# EAGLE design SAMDi_version4 (EAGLE 7.1.0)

## Sheet 1 of 2
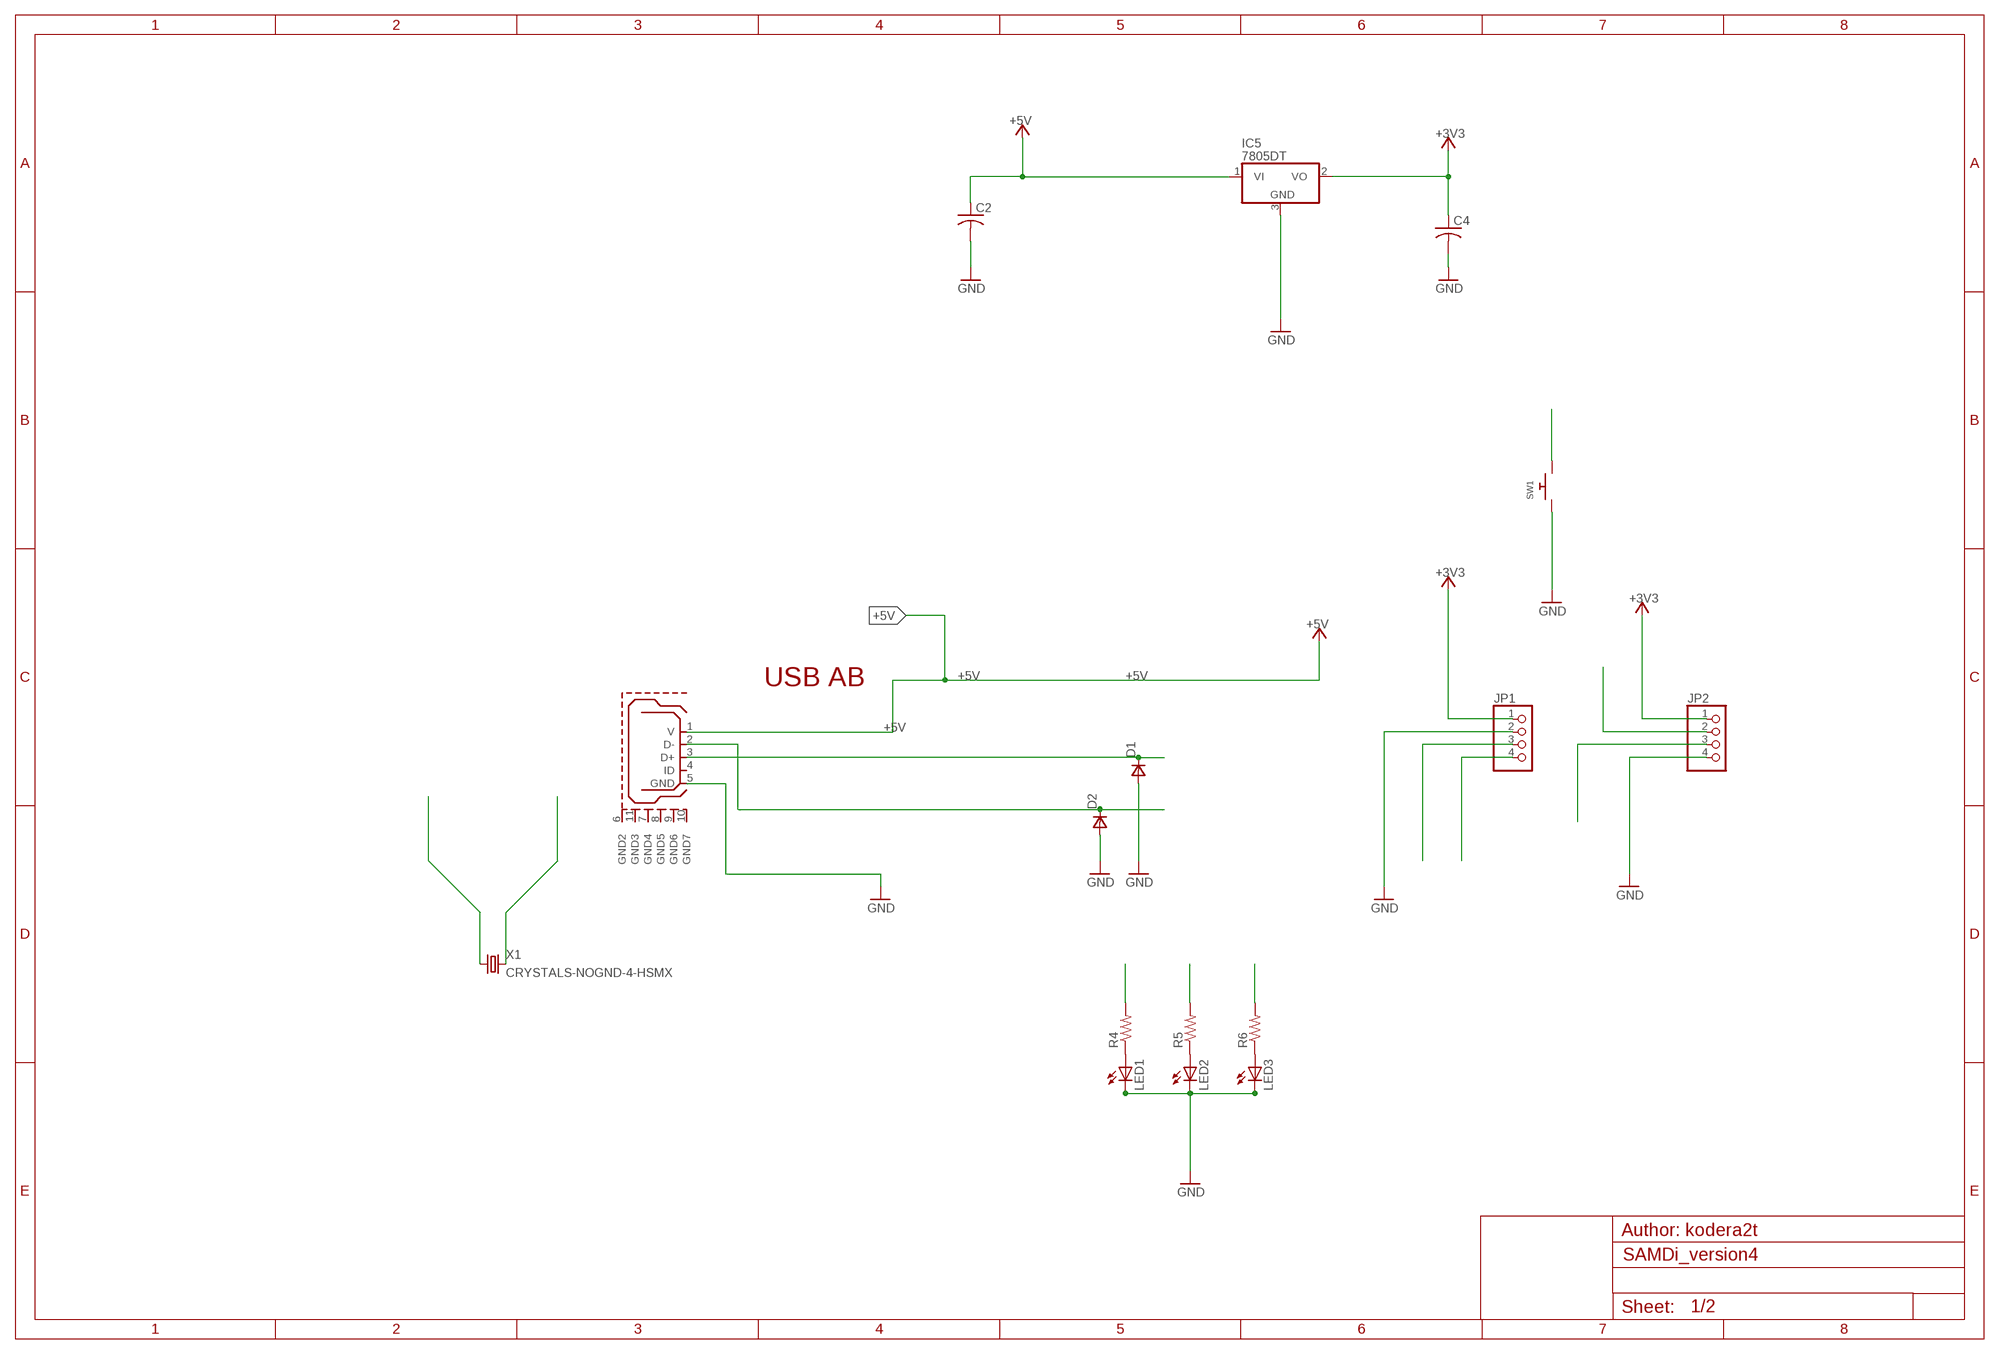
[diagram p0: schematic, sheet 1]

### Parts
C2  C-USC0603  [C0603]
C4  C-USC0603  [C0603]
D1  DSOD323  [SOD323]
D2  DSOD323  [SOD323]
IC5  7805DT  [TO252]
JP1  HEADER-1X4  [1X04_OVAL]
JP2  PINHD-1X4  [1X04]
LED1  LEDCHIP-LED0603  [CHIP-LED0603]
LED2  LEDCHIP-LED0603  [CHIP-LED0603]
LED3  LEDCHIP-LED0603  [CHIP-LED0603]
R4  R-US_R0603  [R0603]
R5  R-US_R0603  [R0603]
R6  R-US_R0603  [R0603]
SW1  SWITCH_PUSHBUTTONSOFTTOUCHSMD_SJ  [PUSHBUTTON_SMD_SJ]
U$1  USB_MICROB  [USB_MICROB_PACKAGE]
X1  CRYSTALS-NOGND-4-HSMX  [HC49-4-HSMX]

### Nets
+3V3: C4.1 IC5.2(VO) JP1.1 JP2.1 ; also sheet 2
+5V [usbvcc]: C2.1 IC5.1(VI) U$1.1(V)
GND [gnd]: C2.2 C4.2 D1.2(A) D2.2(A) IC5.3(GND) JP1.2 JP2.4 LED1.C LED2.C LED3.C SW1.P$1 U$1.5(GND) ; also sheet 2
LED1: R4.2 ; also sheet 2
LED2: R5.2 ; also sheet 2
LED3: R6.2 ; also sheet 2
N$4: LED1.A R4.1
N$10: LED2.A R5.1
N$11: LED3.A R6.1
RX: JP2.3 ; also sheet 2
SCL: JP1.3 ; also sheet 2
SDA: JP1.4 ; also sheet 2
SWITCH1: SW1.P$2 ; also sheet 2
TARGET_USB_N [USBpair]: D2.1(C) U$1.2(D-) ; also sheet 2
TARGET_USB_P [USBpair]: D1.1(C) U$1.3(D+) ; also sheet 2
TX: JP2.2 ; also sheet 2
XTAL11: X1.2 ; also sheet 2
XTAL22: X1.1 ; also sheet 2
Unconnected: U$1.4(ID) U$1.6(GND2) U$1.7(GND4) U$1.8(GND5) U$1.9(GND6) U$1.10(GND7) U$1.11(GND3)

### Notes on the sheet
- USB AB
- Author: kodera2t

## Sheet 2 of 2
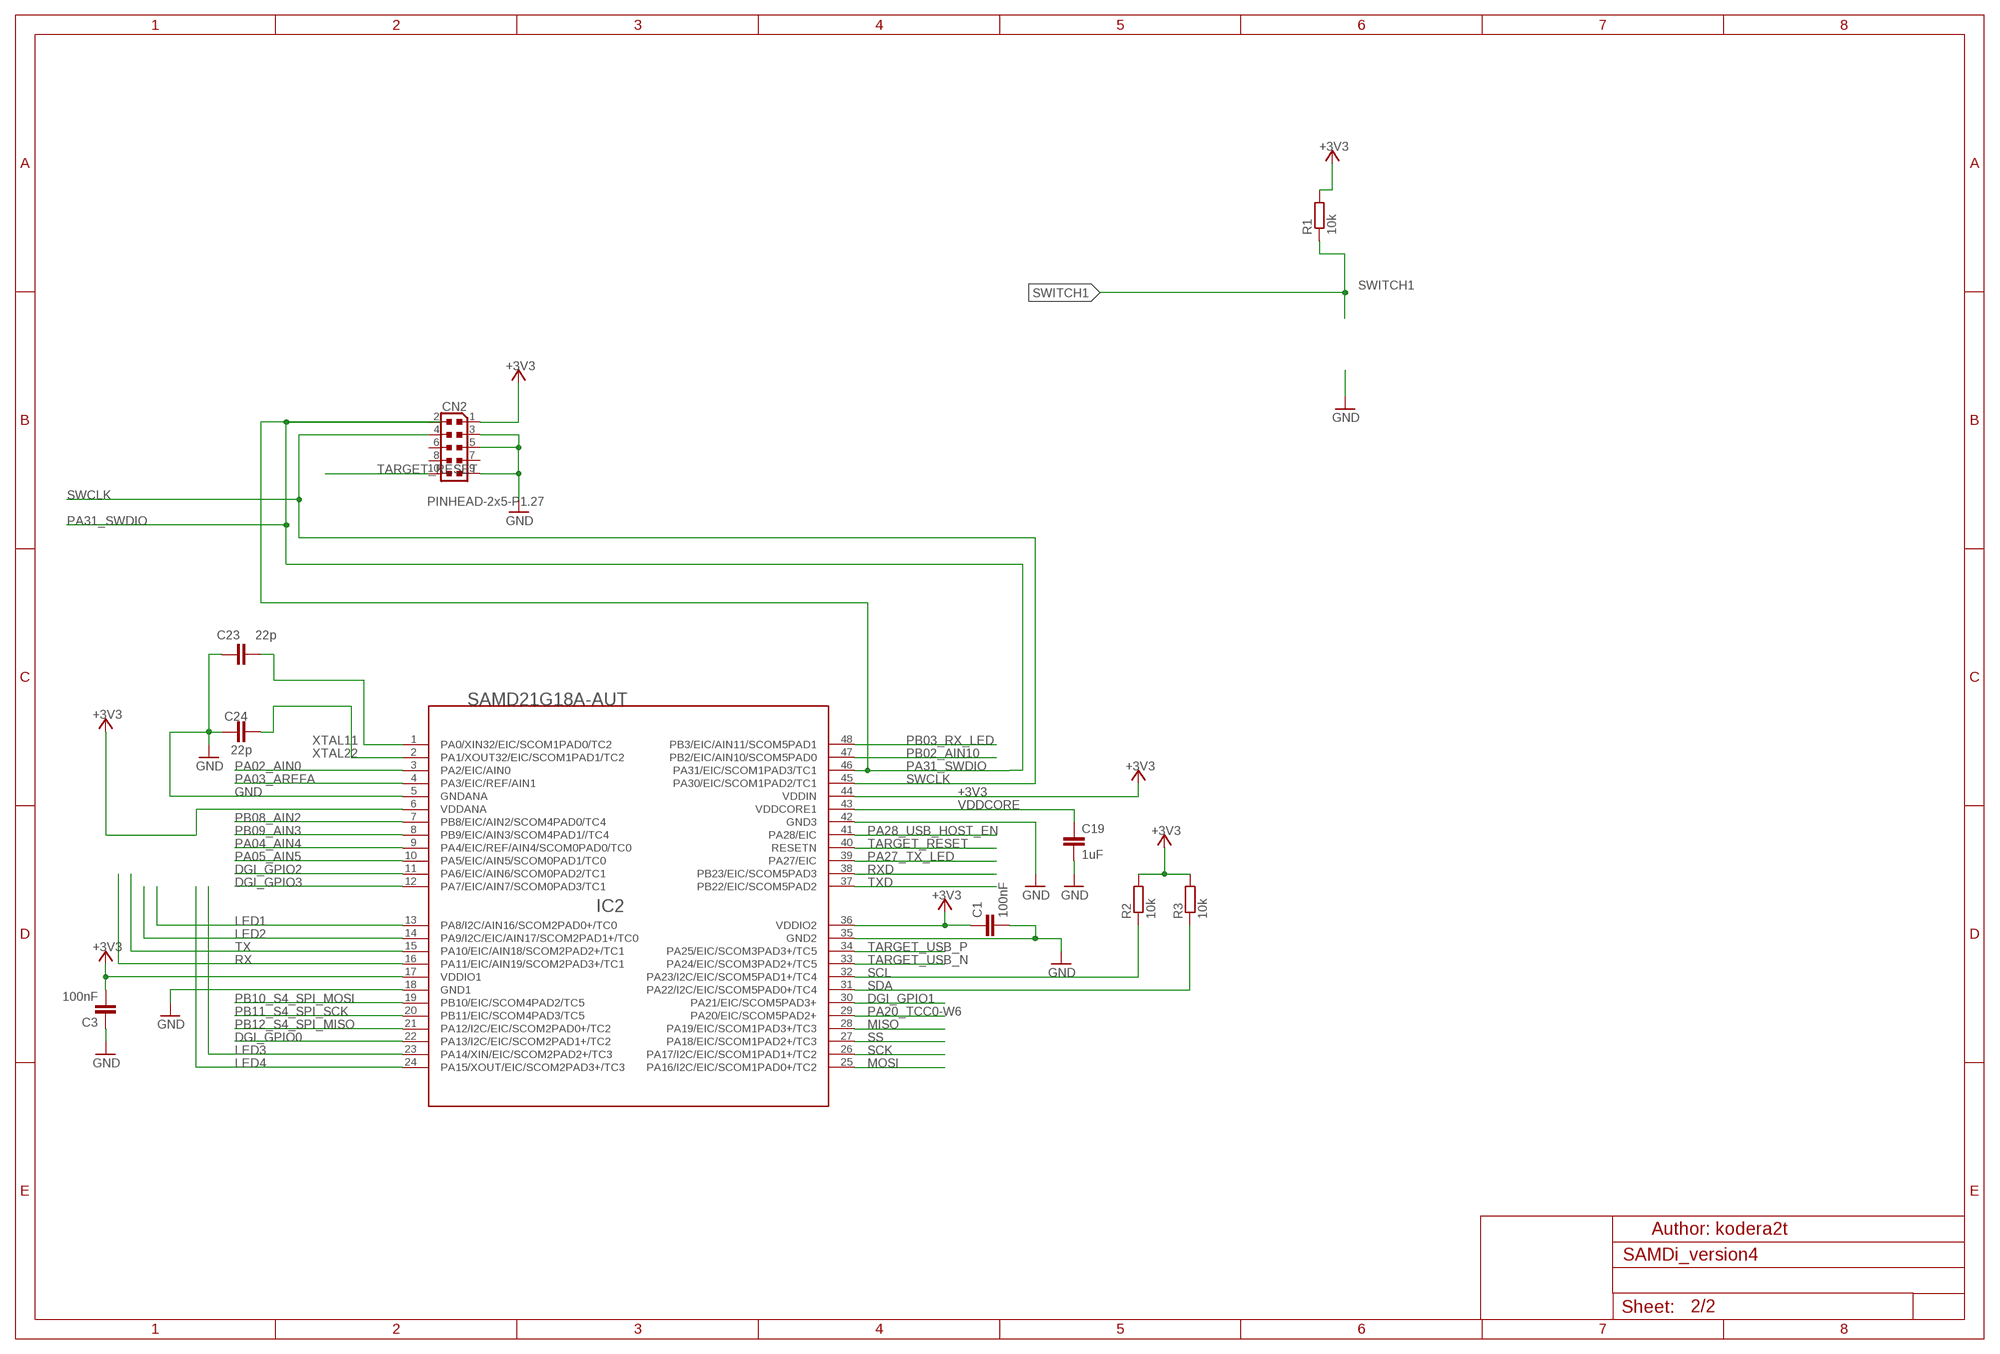
[diagram p1: schematic, sheet 2]

### Parts
C1  100nF  0015_100NF_0603  [C0603-ROUND]
C3  100nF  0015_100NF_0603  [C0603-ROUND]
C19  1uF  0006_1UF_0603/GRM188R61E105KA12D  [C0603-ROUND]
C23  22p  0014_22PF_0603  [C0603-ROUND]
C24  22p  0014_22PF_0603  [C0603-ROUND]
CN2  PINHEAD-2x5-P1.27  0171_PH127-205DF055G00AROUND-PADS  [PINHEAD_2X05_127]
IC2  SAMD21G18A-AUT  1792_SAMD21G18A-AUT  [TQFP48-7X7]
R1  10k  0028_CR0603JW103L  [R0603-ROUND]
R2  10k  0028_CR0603JW103L  [R0603-ROUND]
R3  10k  0028_CR0603JW103L  [R0603-ROUND]

### Nets
+3V3: C1.1 C3.2 CN2.1 IC2.6(VDDANA) IC2.17(VDDIO1) IC2.36(VDDIO2) IC2.44(VDDIN) R1.2 R2.2 R3.2 ; also sheet 1
DGI_GPIO0: IC2.22(PA13/I2C/EIC/SCOM2PAD1+/TC2)
DGI_GPIO1: IC2.30(PA21/EIC/SCOM5PAD3+)
DGI_GPIO2: IC2.11(PA6/EIC/AIN6/SCOM0PAD2/TC1)
DGI_GPIO3: IC2.12(PA7/EIC/AIN7/SCOM0PAD3/TC1)
GND [gnd]: C1.2 C3.1 C19.2 C23.1 C24.1 CN2.3 CN2.5 CN2.9 IC2.5(GNDANA) IC2.18(GND1) IC2.35(GND2) IC2.42(GND3) ; also sheet 1
LED1: IC2.13(PA8/I2C/AIN16/SCOM2PAD0+/TC0) ; also sheet 1
LED2: IC2.14(PA9/I2C/EIC/AIN17/SCOM2PAD1+/TC0) ; also sheet 1
LED3: IC2.23(PA14/XIN/EIC/SCOM2PAD2+/TC3) ; also sheet 1
LED4: IC2.24(PA15/XOUT/EIC/SCOM2PAD3+/TC3)
MISO: IC2.28(PA19/EIC/SCOM1PAD3+/TC3)
MOSI: IC2.25(PA16/I2C/EIC/SCOM1PAD0+/TC2)
PA02_AIN0: IC2.3(PA2/EIC/AIN0)
PA03_AREFA: IC2.4(PA3/EIC/REF/AIN1)
PA04_AIN4: IC2.9(PA4/EIC/REF/AIN4/SCOM0PAD0/TC0)
PA05_AIN5: IC2.10(PA5/EIC/AIN5/SCOM0PAD1/TC0)
PA20_TCC0-W6: IC2.29(PA20/EIC/SCOM5PAD2+)
PA27_TX_LED: IC2.39(PA27/EIC)
PA28_USB_HOST_EN: IC2.41(PA28/EIC)
PA31_SWDIO: CN2.2 IC2.46(PA31/EIC/SCOM1PAD3/TC1)
PB02_AIN10: IC2.47(PB2/EIC/AIN10/SCOM5PAD0)
PB03_RX_LED: IC2.48(PB3/EIC/AIN11/SCOM5PAD1)
PB08_AIN2: IC2.7(PB8/EIC/AIN2/SCOM4PAD0/TC4)
PB09_AIN3: IC2.8(PB9/EIC/AIN3/SCOM4PAD1//TC4)
PB10_S4_SPI_MOSI: IC2.19(PB10/EIC/SCOM4PAD2/TC5)
PB11_S4_SPI_SCK: IC2.20(PB11/EIC/SCOM4PAD3/TC5)
PB12_S4_SPI_MISO: IC2.21(PA12/I2C/EIC/SCOM2PAD0+/TC2)
RX: IC2.16(PA11/EIC/AIN19/SCOM2PAD3+/TC1) ; also sheet 1
RXD: IC2.38(PB23/EIC/SCOM5PAD3)
SCK: IC2.26(PA17/I2C/EIC/SCOM1PAD1+/TC2)
SCL: IC2.32(PA23/I2C/EIC/SCOM5PAD1+/TC4) R2.1 ; also sheet 1
SDA: IC2.31(PA22/I2C/EIC/SCOM5PAD0+/TC4) R3.1 ; also sheet 1
SS: IC2.27(PA18/EIC/SCOM1PAD2+/TC3)
SWCLK: CN2.4 IC2.45(PA30/EIC/SCOM1PAD2/TC1)
SWITCH1: R1.1 ; also sheet 1
TARGET_RESET: CN2.10 IC2.40(RESETN)
TARGET_USB_N [USBpair]: IC2.33(PA24/EIC/SCOM3PAD2+/TC5) ; also sheet 1
TARGET_USB_P [USBpair]: IC2.34(PA25/EIC/SCOM3PAD3+/TC5) ; also sheet 1
TX: IC2.15(PA10/EIC/AIN18/SCOM2PAD2+/TC1) ; also sheet 1
TXD: IC2.37(PB22/EIC/SCOM5PAD2)
VDDCORE: C19.1 IC2.43(VDDCORE1)
XTAL11: C23.2 IC2.1(PA0/XIN32/EIC/SCOM1PAD0/TC2) ; also sheet 1
XTAL22: C24.2 IC2.2(PA1/XOUT32/EIC/SCOM1PAD1/TC2) ; also sheet 1
Unconnected: CN2.6 CN2.7 CN2.8

### Notes on the sheet
- Author: kodera2t

## Library data of the parts
C1 C3 = Condensatori:0015_100NF_0603: 100nF 0603 50V; CASE: 0603; MONTHLY_USAGE: _____; PART_NUMBER: cl10b104kbnc; PRICE: _____; SUPPLIER: _____; TYPE: Condensatori
C2 C4 = resistor:C-US: CAPACITOR, American symbol
C19 = Condensatori:0006_1UF_0603/GRM188R61E105KA12D: 1uF 0603; CASE: 0603; MONTHLY_USAGE: _____; PART_NUMBER: 1uF_0603/GRM188R61E105KA12D; PRICE: _____; SUPPLIER: _____; TYPE: Condensatori
C23 C24 = Condensatori:0014_22PF_0603: 22pF 0603; CASE: 0603; MONTHLY_USAGE: _____; PART_NUMBER: 22pF_0603; PRICE: _____; SUPPLIER: _____; TYPE: Condensatori
CN2 = Connettori:0171_PH127-205DF055G00A: 2x5 PASSO 1,27
D1 D2 = zetex:D: DIODE; MPN: CDSOD323-T05C; OC_FARNELL: 1824860; OC_NEWARK: 79R6078
IC2 = IntegratedCircuits:1792_SAMD21G18A-AUT: Atmel D21 32bit ARM Cortex-M0 microcontroller - 48 PIN TQFP 256KB flash memory + 32KB SRAM
IC5 = linear:78*: Positive VOLTAGE REGULATOR Source: http://cache.national.com/ds/LM/LM78L05.pdf http://www.fairchildsemi.com/ds/LM/LM7805.pdf
JP1 = OLED_mod:HEADER-1X4: PIN HEADER
JP2 = pinhead:PINHD-1X4: PIN HEADER
LED1-LED3 = led:LED: LED OSRAM: - CHIPLED LG R971, LG N971, LY N971, LG Q971, LY Q971, LO R971, LY R971 LH N974, LH R974 LS Q976, LO Q976, LY Q976 LO Q996 - Hyper CHIPLED LW Q18S LB Q993, LB Q99A, LB R99A - SideLED LS A670, LO A670, LY A670, LG A670, LP A670 LB A673, LV A673, LT A673, LW A673 LH A674 LY A675 LS A676, LA A676, LO A676, LY A676, LW A676 LS A679, LY A679, LG A679 - Hyper Micro SIDELED® LS Y876, LA Y876, LO Y876, LY Y876 LT Y87S - SmartLED LW L88C, LW L88S LB L89C, LB L89S, LG L890 LS L89K, LO L89K, LY L89K LS L896, LA L896, LO L896, LY L896 - TOPLED LS T670, LO T670, LY T670, LG T670, LP T670 LSG T670, LSP T670, LSY T670, LOP T670, LYG T670 LG T671, LOG T671, LSG T671 LB T673, LV T673, LT T673, LW T673 LH T674 LS T676, LA T676, LO T676, LY T676, LB T676, LH T676, LSB T676, LW T676 LB T67C, LV T67C, LT T67C, LS T67K, LO T67K, LY T67K, LW E67C LS E67B, LA E67B, LO E67B, LY E67B, LB E67C, LV E67C, LT E67C LW T67C LS T679, LY T679, LG T679 LS T770, LO T770, LY T770, LG T770, LP T770 LB T773, LV T773, LT T773, LW T773 LH T774 LS E675, LA E675, LY E675, LS T675 LS T776, LA T776, LO T776, LY T776, LB T776 LHGB T686 LT T68C, LB T68C - Hyper Mini TOPLED® LB M676 - Mini TOPLED Santana® LG M470 LS M47K, LO M47K, LY M47K Source: http://www.osram.convergy.de LUXEON: - LUMILED® LXK2-PW12-R00, LXK2-PW12-S00, LXK2-PW14-U00, LXK2-PW14-V00 LXK2-PM12-R00, LXK2-PM12-S00, LXK2-PM14-U00 LXK2-PE12-Q00, LXK2-PE12-R00, LXK2-PE12-S00, LXK2-PE14-T00, LXK2-PE14-U00 LXK2-PB12-K00, LXK2-PB12-L00, LXK2-PB12-M00, LXK2-PB14-N00, LXK2-PB14-P00, LXK2-PB14-Q00 LXK2-PR12-L00, LXK2-PR12-M00, LXK2-PR14-Q00, LXK2-PR14-R00 LXK2-PD12-Q00, LXK2-PD12-R00, LXK2-PD12-S00 LXK2-PH12-R00, LXK2-PH12-S00 LXK2-PL12-P00, LXK2-PL12-Q00, LXK2-PL12-R00 Source: www.luxeon.com KINGBRIGHT: KA-3528ASYC Source: www.kingbright.com
R1-R3 = Resistenze:0028_CR0603JW103L: 10K 0603; CASE: 0603; MONTHLY_USAGE: _____; PART_NUMBER: CR0603JW103L; PRICE: _____; SUPPLIER: _____; TYPE: Resistenze
R4-R6 = resistor:R-US_: RESISTOR, American symbol
SW1 = microbuilder:SWITCH_PUSHBUTTON: Buttons SOFTTOUCHSMD_SJ - Soft touch temporary push button (Super Junk Akihabara) Compatible with SKPMANE010 [Mouser: 688-SKPMAN]
U$1 = femtoduino:USB_MICROB: This is the hirose ZX62-B-5PA(11) MICRO-USB B Type female connection.
X1 = IQD-Frequency-Products:CRYSTALS-NOGND: CRYSTALS CAN NOT GROUNDED

## Net classes
0 default: width 0.203 mm, drill 0.406 mm, clearance 0.203 mm
1 USB: width 0.203 mm, drill 0.305 mm, clearance 0.178 mm
2 gnd: width 0.254 mm, drill 0.254 mm, clearance 0.178 mm
3 usbvcc: width 0.203 mm, drill 0.406 mm, clearance 0.178 mm
4 USBpair: width 0.254 mm, drill 0.406 mm, clearance 0.406 mm

## Board
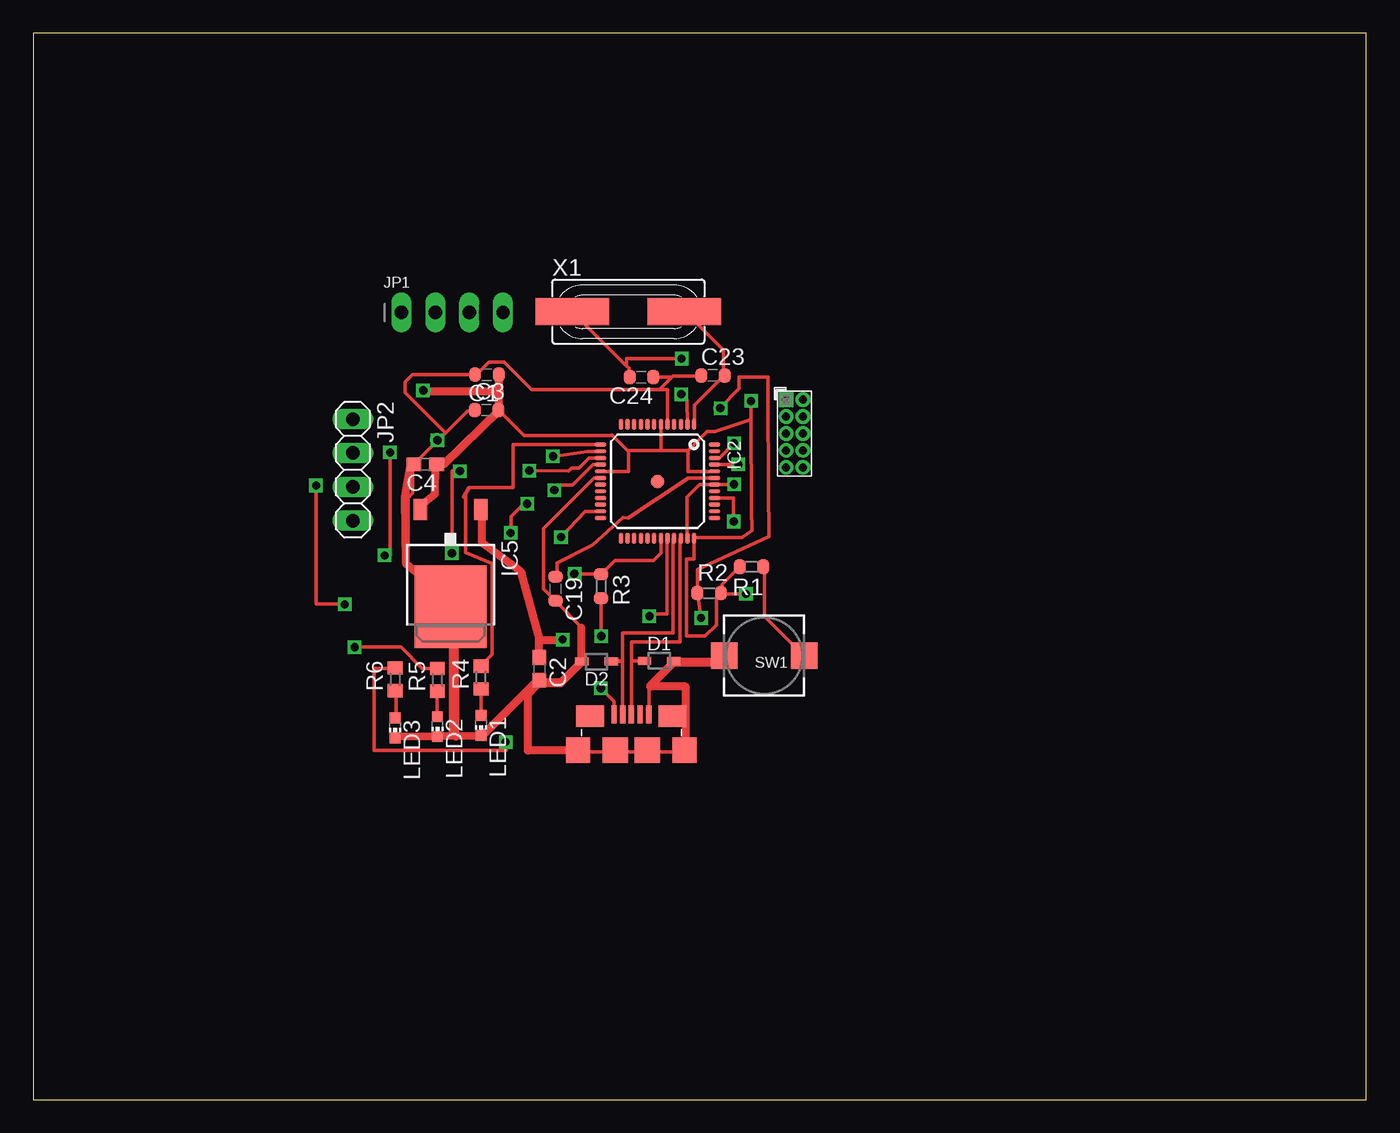
[diagram p2: board, top side]
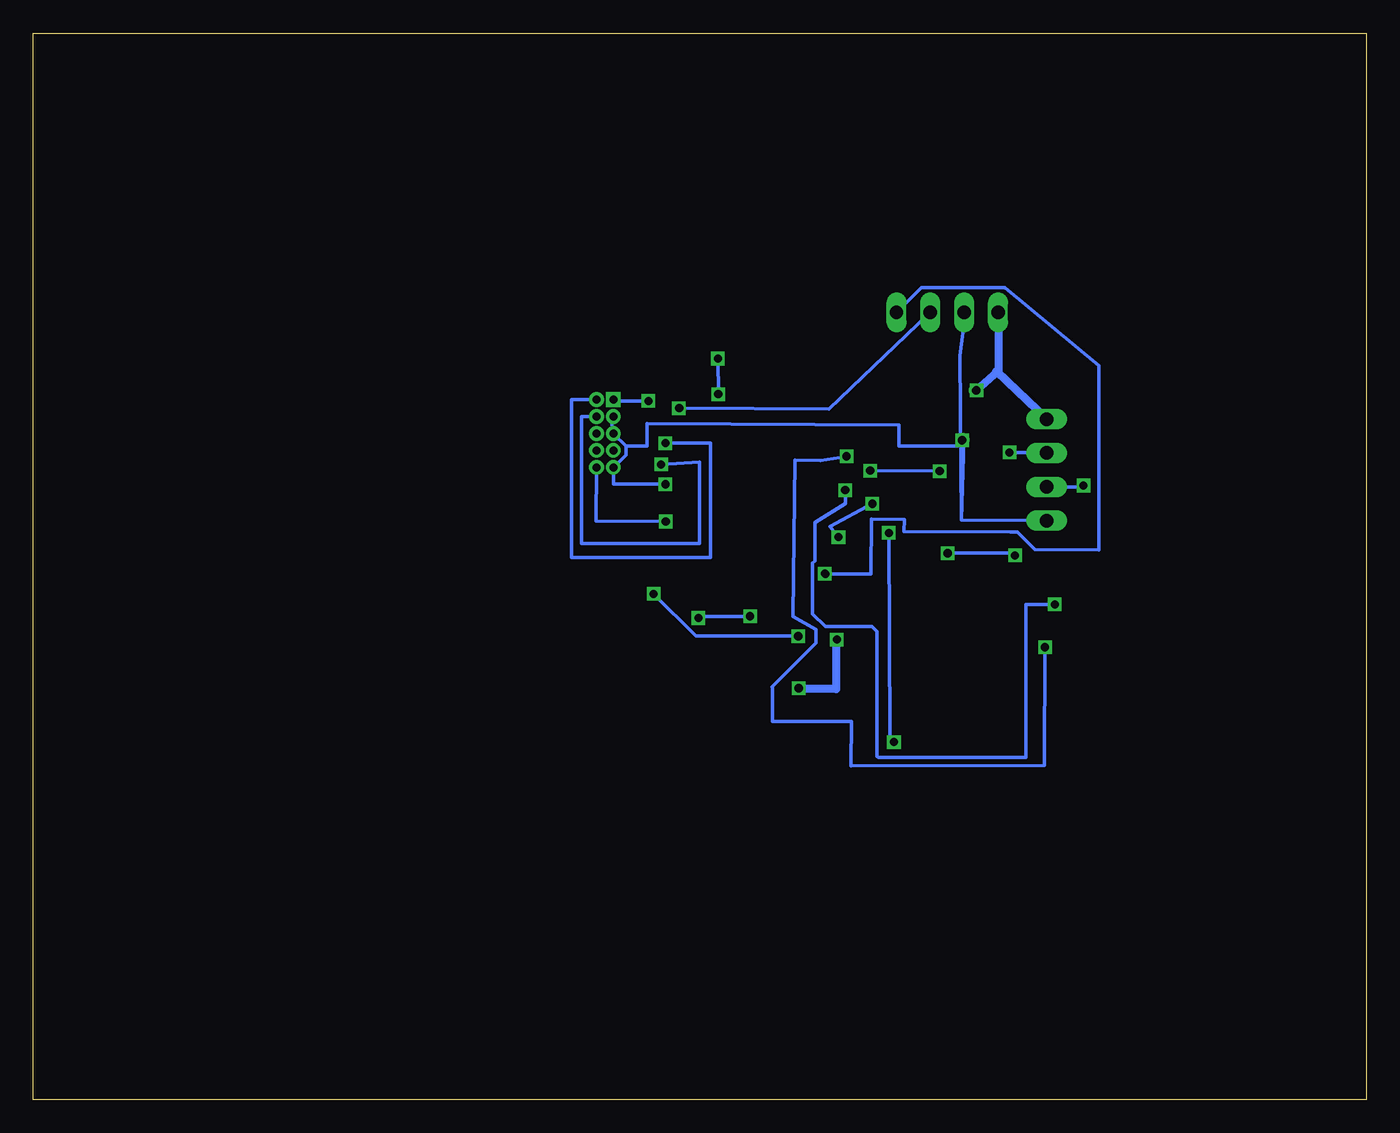
[diagram p3: board, bottom side, seen from below]

Size 100 x 80 mm. Coordinates in mm from the lower left corner, seen from the top.
Outline: 0,0 100,0 100,80 0,80 0,0
Copper layers (1*16): Top 0.035mm / dielectric 1.5mm / Bottom 0.035mm
Design rules "default": minimum track width 10mil, minimum drill 24mil, track to track 8mil, track to pad 8mil, pad to pad 8mil, via to via 8mil, smd to smd 8mil, copper to edge 40mil, drill to drill 8mil, minimum pad ring 10mil, minimum via ring 8mil, stop-mask expansion 4mil, vias tented up to drill 0mil, thermal gap 10mil
tRestrict: area 55.8,46.9 to 58.4,53.2; area 26.9,57.6 to 28.5,60.6; area 29.5,57.5 to 31,60.7; area 32.1,57.4 to 33.5,60.7; area 34.4,57.5 to 36.2,60.5; area 22.5,50.3 to 25.5,51.8; area 22.4,47.6 to 25.5,49.3; area 22.4,45.1 to 25.6,46.7; area 22.3,42.6 to 25.5,44.2
vRestrict: area 43.1,42.6 to 50.7,50.2; area 51.8,30.2 to 57.9,36.5

### Footprints (pad centres in the part's own frame; a part is rotated, then mirrored left to right if it is on the bottom)
C0603-ROUND = smd 0.898 x 1.1: 1 -0.889,0; 2 0.889,0
C0603 = smd 1.1 x 1: 1 -0.85,0; 2 0.85,0
PINHEAD_2X05_127 = drill 0.6 pad 1.016 square: 1 -0.635,2.54 | drill 0.6 pad 1.016: 2 0.635,2.54; 3 -0.635,1.27; 4 0.635,1.27; 5 -0.635,0; 6 0.635,0; 7 -0.635,-1.27; 8 0.635,-1.27; 9 -0.635,-2.54; 10 0.635,-2.54
SOD323 = smd 1 x 0.6: 1 -1.1,0; 2 1.1,0
TQFP48-7X7 = smd 0.85 x 0.32: 1 -4.275,2.75; 2 -4.275,2.25; 3 -4.275,1.75; 4 -4.275,1.25; 5 -4.275,0.75; 6 -4.275,0.25; 7 -4.275,-0.25; 8 -4.275,-0.75; 9 -4.275,-1.25; 10 -4.275,-1.75; 11 -4.275,-2.25; 12 -4.275,-2.75; 25 4.275,-2.75; 26 4.275,-2.25; 27 4.275,-1.75; 28 4.275,-1.25; 29 4.275,-0.75; 30 4.275,-0.25; 31 4.275,0.25; 32 4.275,0.75; 33 4.275,1.25; 34 4.275,1.75; 35 4.275,2.25; 36 4.275,2.75 | smd 0.32 x 0.85: 13 -2.75,-4.275; 14 -2.25,-4.275; 15 -1.75,-4.275; 16 -1.25,-4.275; 17 -0.75,-4.275; 18 -0.25,-4.275; 19 0.25,-4.275; 20 0.75,-4.275; 21 1.25,-4.275; 22 1.75,-4.275; 23 2.25,-4.275; 24 2.75,-4.275; 37 2.75,4.275; 38 2.25,4.275; 39 1.75,4.275; 40 1.25,4.275; 41 0.75,4.275; 42 0.25,4.275; 43 -0.25,4.275; 44 -0.75,4.275; 45 -1.25,4.275; 46 -1.75,4.275; 47 -2.25,4.275; 48 -2.75,4.275 | smd 1 x 1: P$1 0,0
TO252 = smd 1 x 1.6: 1 -2.28,-4.8; 2 2.28,-4.8 | smd 5.4 x 6.2: 3 0,2.5
1X04_OVAL = drill 1 long: 1 -3.81,0; 2 -1.27,0; 3 1.27,0; 4 3.81,0
1X04 = drill 1.016 long: 1 -3.81,0; 2 -1.27,0; 3 1.27,0; 4 3.81,0
CHIP-LED0603 = smd 0.8 x 0.8: A 0,-0.75; C 0,0.75
R0603-ROUND = smd 0.898 x 1.1: 1 -0.889,0; 2 0.889,0
R0603 = smd 1 x 1.1: 1 -0.85,0; 2 0.85,0
PUSHBUTTON_SMD_SJ = smd 2 x 2: P$1 3,0; P$2 -3,0
USB_MICROB_PACKAGE = smd 0.4 x 1.35: 1 -1.3,-0.68; 2 -0.64,-0.68; 3 0,-0.68; 4 0.66,-0.68; 5 1.3,-0.68 | smd 2.1 x 1.6: 6 -3.1,-0.8; 11 3.1,-0.8 | smd 1.8 x 1.9: 7 -4,-3.35; 10 4,-3.35 | smd 1.9 x 1.9: 8 -1.2,-3.35; 9 1.2,-3.35
HC49-4-HSMX = smd 5.5 x 2: 1 -4.2,0; 2 4.2,0

### Placement (x,y rotation side)
C1  34.04,54.39 180 top
C2  37.97,32.32 270 top
C3  34,51.72 0 top
C4  29.4,47.66 180 top
C19  39.18,38.32 270 top
C23  50.99,54.32 0 top
C24  45.62,54.2 180 top
CN2  57.12,49.97 0 top
D1  46.96,32.92 0 top
D2  42.26,32.86 180 top
IC2  46.83,46.39 270 top
IC5  31.31,39.47 180 top
JP1  31.43,59.05 0 top
JP2  23.97,47.24 270 top
LED1  33.59,28.07 180 top
LED2  30.32,27.97 180 top
LED3  27.15,27.88 180 top
R1  53.88,39.97 180 top
R2  50.7,38 0 top
R3  42.61,38.51 270 top
R4  33.59,31.65 90 top
R5  30.32,31.5 90 top
R6  27.15,31.53 90 top
SW1  54.83,33.31 180 top
U$1  44.86,29.56 0 top
X1  44.64,59.12 0 top

### Tracks (layer width: path | path; a pad name or v marks a point on that pad's centre or on a via)
+3V3  (via drill 0.61)
  Top 0.254: IC5.2 29.03,44.35 30.18,45.49 30.18,47.55 C4.1 30.29,47.78 30.98,47.78 34.86,51.66 C3.2 | R2.2 51.66,38.06 51.66,38.63 52.92,39.89 R1.2 | 49.61,42.18 53.18,42.18 53.91,42.7 53.89,44.32 53.86,51.03 | 53.86,51.03 51.14,50.13 50.55,50.13 49.12,48.7 | 49.61,42.18 IC2.36 | C3.2 34.98,51.66 36.8,49.84 43.37,49.84 43.37,49.85 43.43,49.85 44.58,48.7 44.67,48.7 | 34.98,53.33 34.98,51.78 C3.2 | 34.98,53.33 34.98,54.29 C1.1 | 34.98,53.33 34.92,53.28 34.92,53.21 v29.28,53.21 | 44.67,48.7 47.12,48.7 | 47.12,48.7 49.12,48.7 | IC2.6 47.08,48.74 47.12,48.7 | 44.67,48.7 44.67,47.12 42.56,47.12 IC2.17 | IC2.44 49.12,47.14 49.12,48.7 | 49.61,42.18 49.56,42.18 49.56,40.55 49.02,40.55 49.02,34.77 50.39,34.77 51.24,35.62 51.24,37.66 R2.2 | R3.2 v42.61,34.77 | v53.47,37.94 51.66,37.94 R2.2 | 53.86,51.03 53.86,52.15 v53.85,52.42
  Bottom 0.254: 27.55,54.63 27.55,58.98 27.59,59.02 JP1.1 | 27.55,54.63 24,51.09 JP2.1 | v29.28,53.21 27.66,54.63 27.55,54.63 | v42.61,34.77 50.29,34.77 v53.47,37.94 | v53.85,52.42 56.39,52.42 CN2.1
  Bottom 0.61: 27.59,59.02 27.59,54.64 29.27,53.15
+5V  (via drill 0.61)
  Top 0.254: 37.95,34.51 36.72,39.59 33.6,41.72 33.6,44.23 IC5.1 | 37.95,34.51 37.95,33.7 C2.1 | U$1.1 43.56,29.88 v42.58,30.86 | v39.72,34.51 37.95,34.51
  Bottom 0.254: v42.58,30.86 39.72,30.86 v39.72,34.51
  Bottom 0.61: v42.58,30.86 39.81,30.86 39.75,30.8 39.75,34.48
GND  (via drill 0.61)
  Top 0.254: 30.92,50.01 32.58,51.66 33.03,51.66 C3.1 | 30.92,50.01 30.35,49.44 | 30.35,49.44 28.57,47.66 C4.2 28.46,47.55 28.46,45.49 28.12,45.15 28.12,40.12 31.2,37.03 IC5.3 31.32,36.92 31.32,27.32 | 30.92,50.01 27.89,53.03 27.89,53.84 28.46,54.41 33.15,54.41 C1.2 33.26,54.41 34.18,55.32 35.32,55.32 37.38,53.26 46.98,53.26 | 46.98,53.26 47.9,54.18 | 47.9,54.18 48.01,54.29 50.06,54.29 C23.1 | SW1.P$1 51.78,33.26 51.55,33.03 48.12,33.03 D1.2 48.01,32.92 46.18,31.09 | 46.18,31.09 46.18,28.92 U$1.5 | LED3.C 27.2,27.2 30.29,27.2 LED2.C 30.4,27.32 31.32,27.32 | 31.32,27.32 33.49,27.32 LED1.C 33.72,27.32 36.95,30.55 | IC2.18 42.52,46.63 42.06,46.63 38.29,42.86 38.29,38.29 39.09,37.49 C19.2 39.2,37.38 41.15,35.43 41.15,32.92 D2.2 39.77,31.47 C2.2 37.95,31.55 36.95,30.55 | v30.29,49.49 30.35,49.44 | C24.1 47.9,54.2 47.9,54.18 | 46.98,53.26 47.58,53.26 IC2.5 | IC2.35 49.05,42.14 49.05,45.21 49.98,46.14 IC2.42 52.07,46.14 v52.58,46.16 | 46.18,31.09 46.13,31.09 46.13,31.11 48.86,31.11 48.86,26.1 40.07,26.1 40.07,26.26 36.95,26.26 36.95,30.55
  Bottom 0.254: 55.55,49.03 55.55,48.35 56.46,47.43 CN2.9 56.48,46.16 v52.58,46.16 | 55.55,49.03 56.46,49.95 CN2.5 56.58,50.06 56.58,51.21 CN2.3 | 30.38,43.49 30.48,55.82 30.06,58.98 JP1.2 | 30.38,43.49 24,43.43 JP2.4 | 55.55,49.03 53.94,49.03 53.94,50.74 35.05,50.61 35.05,49.03 30.63,49.03 30.23,49.44 | 30.23,49.44 30.18,49.49 30.38,43.49 | v30.29,49.49 30.23,49.44
LED1
  Top 0.254: IC2.13 42.52,49.15 35.99,49.15 36.01,47.91 36.01,45.91 32.7,45.91 32.29,45.21 32.44,45.28 32.44,41.03 34.4,40.23 34.4,33.38 33.6,32.58 R4.2
LED2  (via drill 0.61)
  Top 0.254: IC2.14 41.59,48.64 v38.99,48.26 | v24.1,33.94 27.59,33.94 29.18,32.35 R5.2
  Bottom 0.254: v38.99,48.26 40.96,47.94 42.86,47.97 42.99,36.26 41.27,35.27 41.27,34.26 44.58,30.96 44.55,30.96 44.55,28.35 38.61,28.35 38.67,25.02 24.16,25.08 v24.1,33.94
LED3  (via drill 0.61)
  Top 0.254: IC2.23 41.41,44.14 v39.59,42.2 | v37.05,44.7 36.86,44.77 35.85,43.75 35.85,42.51 v35.81,42.51 | v35.43,26.83 35.47,26.83 35.47,26.19 25.56,26.19 25.56,32.35 27.15,32.35 R6.2
  Bottom 0.254: v39.59,42.2 40.23,42.99 v37.05,44.7 | v35.81,42.51 35.72,27.11 v35.43,26.83
N$1
  Top 0.61: 48.96,26.13 48.96,30.96 48.93,30.99 46.29,30.99 46.29,31.05 48.04,32.8 50.99,32.8 51.02,32.77
N$2
  Top 0.61: 40.48,26.19 37.12,26.19 37.12,30.45 37.15,30.45 37.75,31.05
N$4
  Top 0.254: LED1.A 33.6,28.92 33.6,30.75 R4.1
N$5
  Top 0.61: 39.72,34.45 38.04,34.45 36.64,39.5
N$6
  Top 0.61: 37.91,34.64 37.91,33.56
N$7
  Top 0.61: 36.54,39.66 33.69,41.78 33.69,44.45
N$8
  Top 0.61: 37.53,31.15 33.69,27.27 27.02,27.21
N$9
  Top 0.61: 31.69,27.21 31.66,35.02
N$10
  Top 0.254: LED2.A 30.29,28.8 30.29,30.63 R5.1
N$11
  Top 0.254: LED3.A 27.2,28.69 27.2,30.63 R6.1
N$12
  Top 0.61: 38.26,31.27 39.56,31.24 41.12,32.83 41.12,35.4
N$13
  Top 0.61: 29.24,44.7 30.13,45.43 30.16,47.69 30.83,47.69 34.96,51.69 34.92,54.52
N$14
  Top 0.61: 29.3,53.15 34.99,53.15
N$15
  Bottom 0.61: 27.75,54.64 23.91,51.02
N$16
  Top 0.61: 28.73,39.56 27.97,40.16 27.91,45.21 28.26,47.37
N$17  (via drill 0.61)
  other vias: 30.32,49.47
N$18  (via drill 0.61)
  other vias: 29.24,53.21
N$19  (via drill 0.61)
  other vias: 40.61,39.47
N$20  (via drill 0.61)
  other vias: 51.56,51.88
PA31_SWDIO  (via drill 0.61)
  Top 0.254: IC2.46 51.47,48.14 v52.58,49.24
  Bottom 0.254: v52.58,49.24 49.18,49.24 49.18,40.67 59.63,40.67 59.63,52.51 CN2.2
RX  (via drill 0.61)
  Top 0.254: IC2.16 41.98,47.64 40.45,46.1 39.53,46.1 v39.08,45.72 | v21.21,46.07 21.21,37.18 23.37,37.18 v23.37,37.15
  Bottom 0.254: v39.08,45.72 39.08,44.7 41.37,43.27 41.37,40.42 41.53,40.26 41.53,36.45 40.58,35.5 37.08,35.5 36.7,35.12 36.7,25.75 36.61,25.65 25.53,25.65 25.53,37.15 v23.37,37.15 | JP2.3 21.21,45.97 v21.21,46.07
SCL  (via drill 0.61)
  Top 0.254: v51.54,51.88 52.96,53.34 52.96,54.21 55.11,54.21 55.14,44.39 55.18,43.75 55.18,42.26 49.84,39.78 49.84,38.06 R2.1 v50.1,36.13 | IC2.32 47.53,42.11 47.53,36.45 46.23,36.45 v46.23,36.26
  Bottom 0.254: v51.54,51.88 40.32,51.82 32.8,58.98 JP1.3 | v46.23,36.26 49.82,36.26 v50.1,36.13
SDA  (via drill 0.61)
  Top 0.254: v40.58,39.43 42.52,39.43 R3.1 43.66,40.45 46.55,40.45 47.09,40.99 47.09,41.15 47.08,41.15 IC2.31
  Bottom 0.254: v40.58,39.43 37.15,39.43 37.12,43.56 34.64,43.53 34.67,42.61 26.68,42.58 26.16,42.58 24.86,41.27 20.06,41.23 20.06,55.07 27.09,60.92 33.38,60.92 JP1.4
SWCLK  (via drill 0.61)
  Top 0.254: IC2.45 52.43,47.64 v52.9,47.66
  Bottom 0.254: v52.9,47.66 50.01,47.82 50.01,41.72 58.86,41.72 58.86,51.24 CN2.4
SWITCH1
  Top 0.254: R1.1 54.86,39.89 54.86,36.23 57.72,33.38 SW1.P$2
TARGET_RESET  (via drill 0.61)
  Top 0.254: IC2.40 52.55,45.14 v52.55,43.37
  Bottom 0.254: v52.55,43.37 57.78,43.4 CN2.10
TARGET_USB_N
  Top 0.254: IC2.33 47.99,42.11 47.99,35 44.22,35 44.22,32.92 43.36,32.92 D2.1 44.22,32.86 U$1.2
TARGET_USB_P
  Top 0.254: IC2.34 48.53,42.11 48.53,34.34 44.88,34.34 44.88,32.92 D1.1 44.86,32.92 U$1.3
TX  (via drill 0.61)
  Top 0.254: IC2.15 41.69,48.14 40.93,47.37 40.39,47.37 40.16,47.15 v37.21,47.18 | v32,47.15 31.4,47.15 v31.4,40.99 | v26.35,40.83 26.77,40.83 v26.77,48.55
  Bottom 0.254: v37.21,47.18 v32,47.15 | v31.4,40.99 26.73,40.99 v26.35,40.83 | v26.77,48.55 23.97,48.55 JP2.2
VDDCORE
  Top 0.254: IC2.43 51.09,46.63 49.15,46.63 44.63,43.64 44.26,43.67 41.94,41.62 39.31,40.26 39.3,39.38 C19.1
XTAL11
  Top 0.254: IC2.1 49.61,50.75 49.61,52.12 51.78,54.29 C23.2 51.78,54.41 51.78,56.24 48.92,59.09 X1.2
XTAL22  (via drill 0.61)
  Top 0.254: 44.52,55.03 40.46,59.09 X1.1 | 44.52,55.03 44.69,54.86 44.69,54.29 C24.2 | IC2.2 49.05,52.49 v48.61,52.93 | v48.64,55.59 44.52,55.59 44.52,55.03
  Bottom 0.254: v48.61,52.93 v48.64,55.59